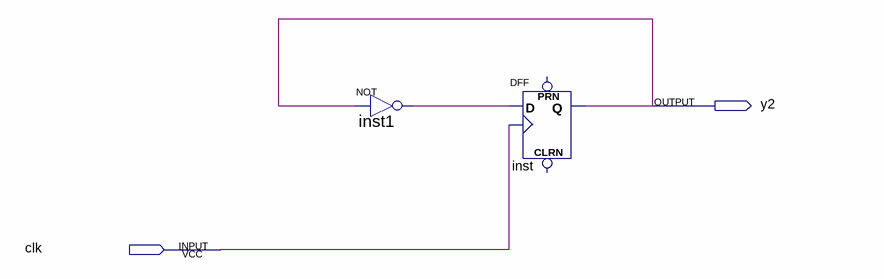
[diagram p0: schematic sheet]
// Quartus schematic 2Xdec.bdf as structural Verilog: 2 symbols, 2 pins
module \2Xdec  (
  input  clk,
  output y2
);

  wire inst1_out;

  not inst1 (inst1_out, y2);
  DFF inst (.CLK(clk), .D(inst1_out), .Q(y2));  // open: CLRN, PRN
endmodule
